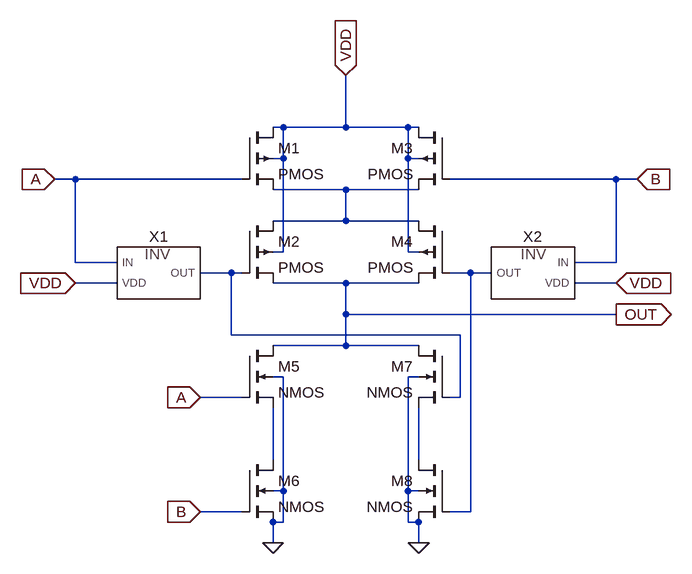
[diagram p0: schematic XorCMOS.asc]
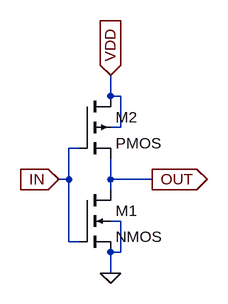
[diagram p1: sub-circuit invcmos.asc]
XorCMOS.asc, the LTspice schematic file:
Version 4
SHEET 1 880 720
WIRE 160 32 144 32
WIRE 256 32 256 -48
WIRE 256 32 160 32
WIRE 352 32 256 32
WIRE 368 32 352 32
WIRE 160 80 160 32
WIRE 160 80 144 80
WIRE 352 80 352 32
WIRE 368 80 352 80
WIRE -160 112 -192 112
WIRE 96 112 -160 112
WIRE 672 112 416 112
WIRE 704 112 672 112
WIRE 256 128 144 128
WIRE 368 128 256 128
WIRE 256 176 256 128
WIRE 256 176 144 176
WIRE 368 176 256 176
WIRE 160 224 160 80
WIRE 160 224 144 224
WIRE 352 224 352 80
WIRE 368 224 352 224
WIRE -160 240 -160 112
WIRE -96 240 -160 240
WIRE 672 240 672 112
WIRE 672 240 608 240
WIRE 80 256 32 256
WIRE 96 256 80 256
WIRE 448 256 416 256
WIRE 480 256 448 256
WIRE -96 272 -160 272
WIRE 256 272 144 272
WIRE 368 272 256 272
WIRE 672 272 608 272
WIRE 256 320 256 272
WIRE 672 320 256 320
WIRE 80 352 80 256
WIRE 432 352 80 352
WIRE 256 368 256 320
WIRE 256 368 144 368
WIRE 368 368 256 368
WIRE 160 416 144 416
WIRE 368 416 352 416
WIRE 96 448 32 448
WIRE 432 448 432 352
WIRE 432 448 416 448
WIRE 144 544 144 464
WIRE 368 544 368 464
WIRE 160 592 160 416
WIRE 160 592 144 592
WIRE 352 592 352 416
WIRE 368 592 352 592
WIRE 96 624 32 624
WIRE 448 624 448 256
WIRE 448 624 416 624
WIRE 160 640 160 592
WIRE 160 640 144 640
WIRE 352 640 352 592
WIRE 368 640 352 640
WIRE 144 672 144 640
WIRE 368 672 368 640
FLAG 144 672 0
FLAG 368 672 0
FLAG -192 112 A
IOPIN -192 112 In
FLAG 704 112 B
IOPIN 704 112 In
FLAG 256 -48 VDD
IOPIN 256 -48 In
FLAG -160 272 VDD
IOPIN -160 272 In
FLAG 672 272 VDD
IOPIN 672 272 In
FLAG 32 448 A
IOPIN 32 448 In
FLAG 32 624 B
IOPIN 32 624 In
FLAG 672 320 OUT
IOPIN 672 320 Out
SYMBOL pmos4 96 32 R0
SYMATTR InstName M1
SYMATTR Value2 l=65nm w=162.5nm
SYMBOL pmos4 96 176 R0
SYMATTR InstName M2
SYMATTR Value2 l=65nm w=162.5nm
SYMBOL pmos4 416 32 M0
SYMATTR InstName M3
SYMATTR Value2 l=65nm w=162.5nm
SYMBOL pmos4 416 176 M0
SYMATTR InstName M4
SYMATTR Value2 l=65nm w=162.5nm
SYMBOL nmos4 96 368 R0
SYMATTR InstName M5
SYMATTR Value2 l=65nm w=65nm
SYMBOL nmos4 96 544 R0
SYMATTR InstName M6
SYMATTR Value2 l=65nm w=65nm
SYMBOL nmos4 416 368 M0
SYMATTR InstName M7
SYMATTR Value2 l=65nm w=65nm
SYMBOL nmos4 416 544 M0
SYMATTR InstName M8
SYMATTR Value2 l=65nm w=65nm
SYMBOL InvCMOS -32 256 R0
SYMATTR InstName X1
SYMBOL InvCMOS 544 256 M0
SYMATTR InstName X2

invcmos.asc, the sub-circuit schematic file:
Version 4
SHEET 1 880 680
WIRE 208 32 208 0
WIRE 224 32 208 32
WIRE 224 80 224 32
WIRE 224 80 208 80
WIRE 160 112 144 112
WIRE 144 160 144 112
WIRE 144 160 128 160
WIRE 208 160 208 128
WIRE 272 160 208 160
WIRE 208 176 208 160
WIRE 224 224 208 224
WIRE 144 256 144 160
WIRE 160 256 144 256
WIRE 224 272 224 224
WIRE 224 272 208 272
WIRE 208 304 208 272
FLAG 208 304 0
FLAG 208 0 VDD
IOPIN 208 0 In
FLAG 128 160 IN
IOPIN 128 160 In
FLAG 272 160 OUT
IOPIN 272 160 Out
SYMBOL nmos4 160 176 R0
SYMATTR InstName M1
SYMATTR Value2 l=65nm w=65nm
SYMBOL pmos4 160 32 R0
SYMATTR InstName M2
SYMATTR Value2 l=65nm w=162.5nm

The netlist it stands for:
* XorCMOS.asc
M1 VDD A N001 VDD PMOS l=65nm w=162.5nm
M2 N001 N002 OUT VDD PMOS l=65nm w=162.5nm
M3 VDD B N001 VDD PMOS l=65nm w=162.5nm
M4 N001 N003 OUT VDD PMOS l=65nm w=162.5nm
M5 OUT A N004 0 NMOS l=65nm w=65nm
M6 N004 B 0 0 NMOS l=65nm w=65nm
M7 OUT N002 N005 0 NMOS l=65nm w=65nm
M8 N005 N003 0 0 NMOS l=65nm w=65nm
XX1 A VDD N002 invcmos
XX2 B VDD N003 invcmos

* block symbol definitions
.subckt invcmos IN VDD OUT
M1 OUT IN 0 0 NMOS l=65nm w=65nm
M2 VDD IN OUT VDD PMOS l=65nm w=162.5nm
.ends invcmos

.model NMOS NMOS
.model PMOS PMOS
.lib standard.mos
.backanno
.end